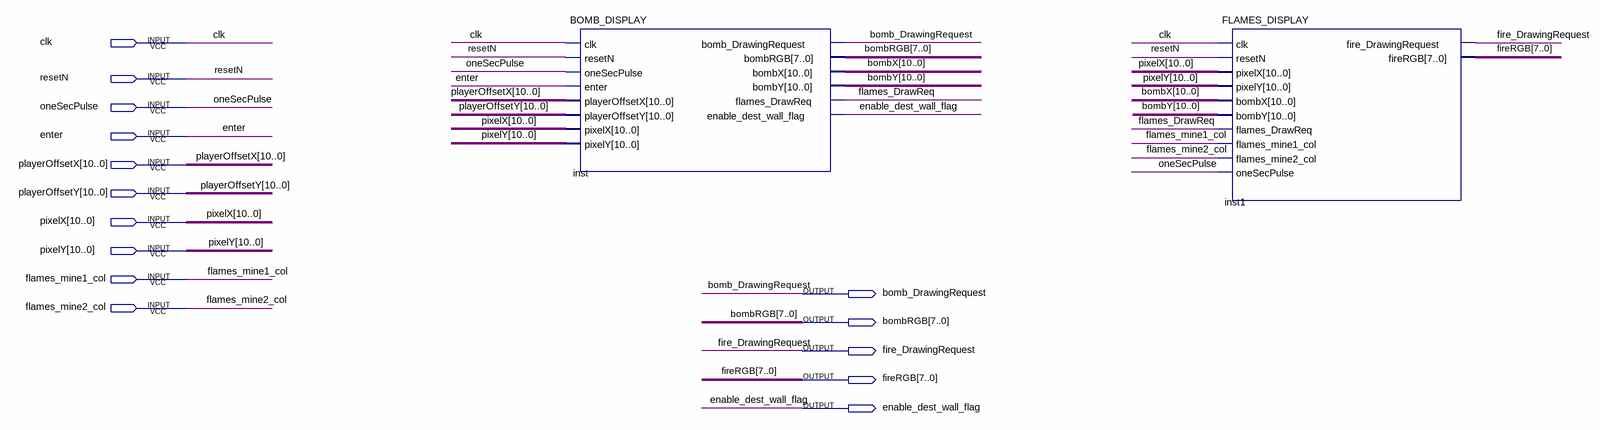
[diagram p0: schematic sheet]
// Quartus schematic BOMB_BLOCK.bdf as structural Verilog: 2 symbols, 15 pins
module BOMB_BLOCK (
  input  clk,
  input  resetN,
  input  oneSecPulse,
  input  enter,
  input  [10:0] playerOffsetX,
  input  [10:0] playerOffsetY,
  input  [10:0] pixelX,
  input  [10:0] pixelY,
  input  flames_mine1_col,
  input  flames_mine2_col,
  output bomb_DrawingRequest,
  output [7:0] bombRGB,
  output fire_DrawingRequest,
  output [7:0] fireRGB,
  output enable_dest_wall_flag
);

  wire flames_DrawReq;
  wire [10:0] bombX, bombY;

  BOMB_DISPLAY inst (
    .clk(clk), .resetN(resetN), .oneSecPulse(oneSecPulse), .enter(enter), .playerOffsetX(playerOffsetX),
    .playerOffsetY(playerOffsetY), .pixelX(pixelX), .pixelY(pixelY),
    .bomb_DrawingRequest(bomb_DrawingRequest), .bombRGB(bombRGB), .bombX(bombX), .bombY(bombY),
    .flames_DrawReq(flames_DrawReq), .enable_dest_wall_flag(enable_dest_wall_flag));
  FLAMES_DISPLAY inst1 (
    .clk(clk), .resetN(resetN), .pixelX(pixelX), .pixelY(pixelY), .bombX(bombX), .bombY(bombY),
    .flames_DrawReq(flames_DrawReq), .flames_mine1_col(flames_mine1_col),
    .flames_mine2_col(flames_mine2_col), .oneSecPulse(oneSecPulse),
    .fire_DrawingRequest(fire_DrawingRequest), .fireRGB(fireRGB));
endmodule
